# EAGLE design test_board (EAGLE 9.3.1)
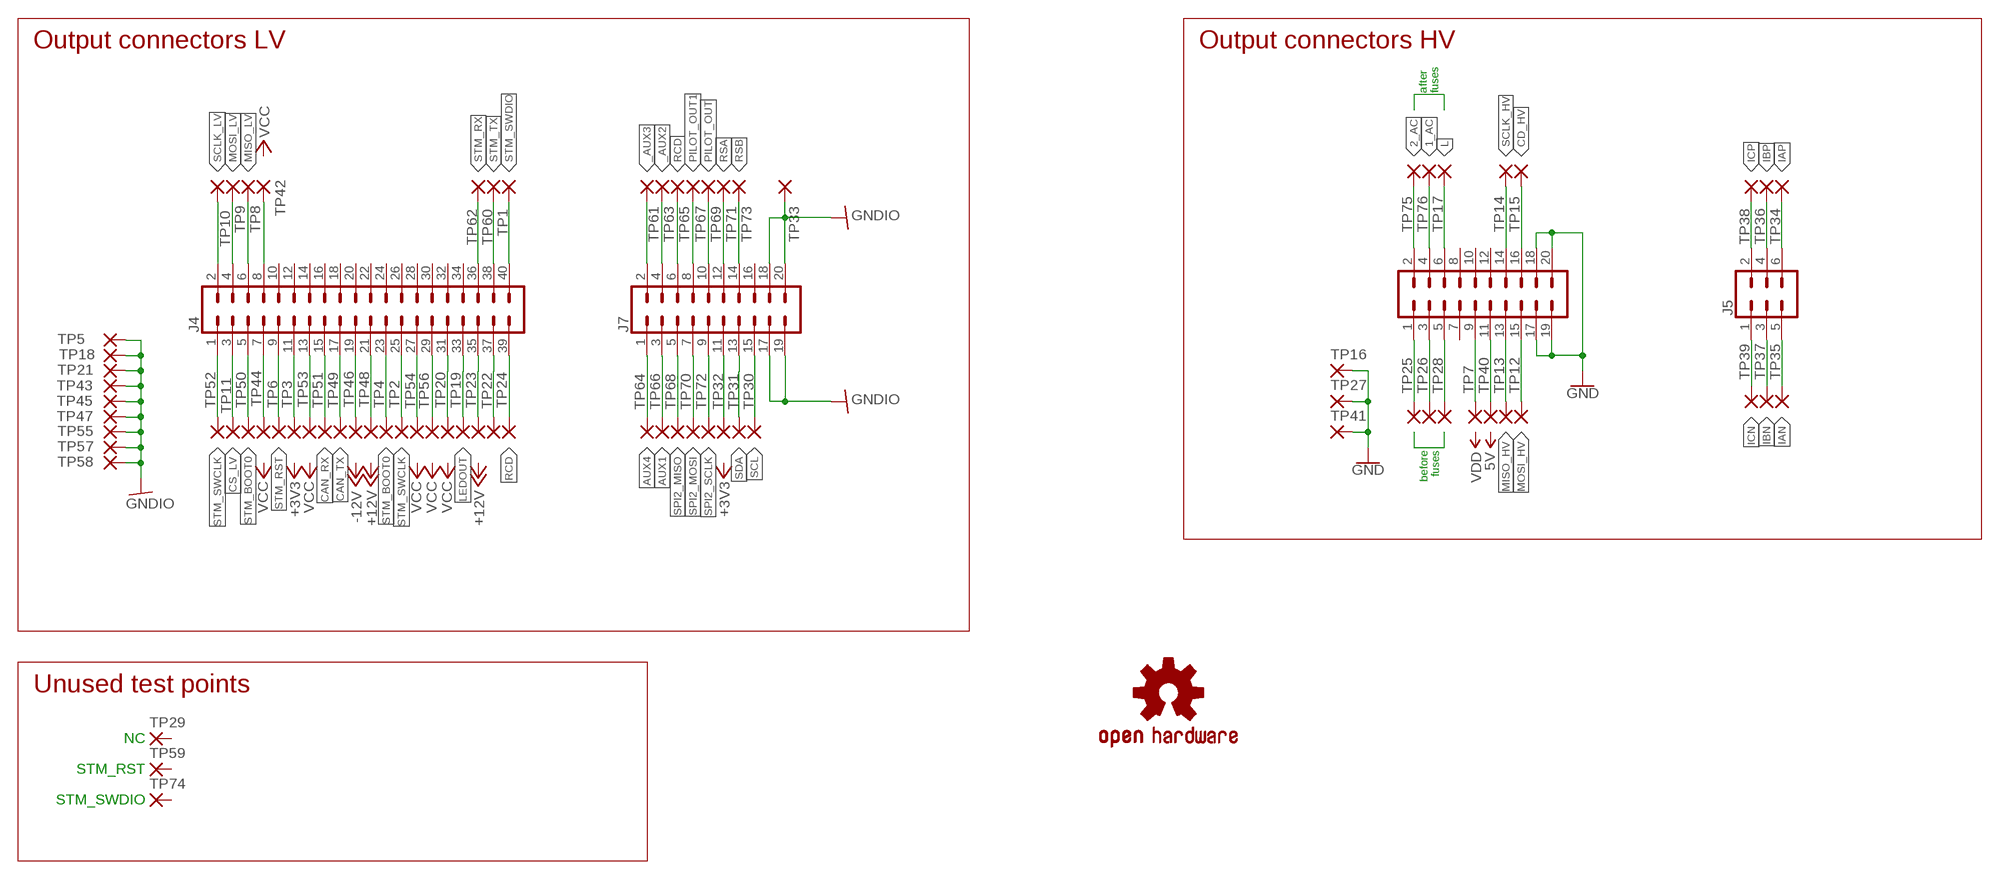
[diagram p0: schematic, sheet 1]

## Parts
J4  CONN_20X2SHROUDED  [2X20_SHROUDED]
J5  CONN_03X2SHROUD  [2X3-SHROUDED]
J7  CONN_10X2  [2X10]
J8  CONN_10X2  [2X10]
TP1  1.35_HOLEROUND  [2,2/1,35_ROUND]
TP2  1.35_HOLEOFFSET  [1,7/1,35_OFFSET]
TP3  1.35_HOLEROUND  [2,2/1,35_ROUND]
TP4  1.35_HOLEROUND  [2,2/1,35_ROUND]
TP5  1.35_HOLELONG  [1,7/1,35_LONG]
TP6  1.35_HOLEROUND  [2,2/1,35_ROUND]
TP7  1.35_HOLEROUND  [2,2/1,35_ROUND]
TP8  1.35_HOLEOFFSET  [1,7/1,35_OFFSET]
TP9  1.35_HOLEOFFSET  [1,7/1,35_OFFSET]
TP10  1.35_HOLEOFFSET  [1,7/1,35_OFFSET]
TP11  1.35_HOLELONG  [1,7/1,35_LONG]
TP12  1.35_HOLEROUND  [2,2/1,35_ROUND]
TP13  1.35_HOLEROUND  [2,2/1,35_ROUND]
TP14  1.35_HOLEOFFSET  [1,7/1,35_OFFSET]
TP15  1.35_HOLEOFFSET  [1,7/1,35_OFFSET]
TP16  1.35_HOLEROUND  [2,2/1,35_ROUND]
TP17  1.35_HOLEROUND  [2,2/1,35_ROUND]
TP18  1.35_HOLELONG  [1,7/1,35_LONG]
TP19  1.35_HOLELONG  [1,7/1,35_LONG]
TP20  1.35_HOLELONG  [1,7/1,35_LONG]
TP21  1.35_HOLELONG  [1,7/1,35_LONG]
TP22  1.35_HOLELONG  [1,7/1,35_LONG]
TP23  1.35_HOLELONG  [1,7/1,35_LONG]
TP24  1.35_HOLELONG  [1,7/1,35_LONG]
TP25  1.35_HOLEROUND  [2,2/1,35_ROUND]
TP26  1.35_HOLEROUND  [2,2/1,35_ROUND]
TP27  1.35_HOLEROUND  [2,2/1,35_ROUND]
TP28  1.35_HOLEROUND  [2,2/1,35_ROUND]
TP29  1.35_HOLELONG  [1,7/1,35_LONG]
TP30  1.35_HOLELONG  [1,7/1,35_LONG]
TP31  1.35_HOLELONG  [1,7/1,35_LONG]
TP32  1.35_HOLELONG  [1,7/1,35_LONG]
TP33  1.35_HOLELONG  [1,7/1,35_LONG]
TP34  1.35_HOLELONG  [1,7/1,35_LONG]
TP35  1.35_HOLELONG  [1,7/1,35_LONG]
TP36  1.35_HOLELONG  [1,7/1,35_LONG]
TP37  1.35_HOLELONG  [1,7/1,35_LONG]
TP38  1.35_HOLELONG  [1,7/1,35_LONG]
TP39  1.35_HOLELONG  [1,7/1,35_LONG]
TP40  1.35_HOLELONG  [1,7/1,35_LONG]
TP41  1.35_HOLELONG  [1,7/1,35_LONG]
TP42  1.35_HOLELONG  [1,7/1,35_LONG]
TP43  1.35_HOLELONG  [1,7/1,35_LONG]
TP44  1.35_HOLELONG  [1,7/1,35_LONG]
TP45  1.35_HOLELONG  [1,7/1,35_LONG]
TP46  1.35_HOLELONG  [1,7/1,35_LONG]
TP47  1.35_HOLELONG  [1,7/1,35_LONG]
TP48  1.35_HOLELONG  [1,7/1,35_LONG]
TP49  1.35_HOLEROUND  [2,2/1,35_ROUND]
TP50  1.35_HOLEROUND  [2,2/1,35_ROUND]
TP51  1.35_HOLEROUND  [2,2/1,35_ROUND]
TP52  1.35_HOLEROUND  [2,2/1,35_ROUND]
TP53  1.35_HOLEROUND  [2,2/1,35_ROUND]
TP54  1.35_HOLEROUND  [2,2/1,35_ROUND]
TP55  1.35_HOLEROUND  [2,2/1,35_ROUND]
TP56  1.35_HOLEROUND  [2,2/1,35_ROUND]
TP57  1.35_HOLEROUND  [2,2/1,35_ROUND]
TP58  1.35_HOLEROUND  [2,2/1,35_ROUND]
TP59  1.35_HOLEROUND  [2,2/1,35_ROUND]
TP60  1.35_HOLEROUND  [2,2/1,35_ROUND]
TP61  1.35_HOLEROUND  [2,2/1,35_ROUND]
TP62  1.35_HOLEROUND  [2,2/1,35_ROUND]
TP63  1.35_HOLEROUND  [2,2/1,35_ROUND]
TP64  1.35_HOLEROUND  [2,2/1,35_ROUND]
TP65  1.35_HOLEROUND  [2,2/1,35_ROUND]
TP66  1.35_HOLEROUND  [2,2/1,35_ROUND]
TP67  1.35_HOLEROUND  [2,2/1,35_ROUND]
TP68  1.35_HOLEROUND  [2,2/1,35_ROUND]
TP69  1.35_HOLEROUND  [2,2/1,35_ROUND]
TP70  1.35_HOLEROUND  [2,2/1,35_ROUND]
TP71  1.35_HOLEROUND  [2,2/1,35_ROUND]
TP72  1.35_HOLEROUND  [2,2/1,35_ROUND]
TP73  1.35_HOLEROUND  [2,2/1,35_ROUND]
TP74  1.35_HOLEROUND  [2,2/1,35_ROUND]
TP75  1.35_HOLEROUND  [2,2/1,35_ROUND]
TP76  1.35_HOLEROUND  [2,2/1,35_ROUND]
U$1  OSHW-LOGOL  [OSHW-LOGO-L]

## Nets
1_AC: J8.4 TP76.1(P)
2_AC: J8.2 TP75.1(P)
_AUX2: J7.4 TP63.1(P)
_AUX3: J7.2 TP61.1(P)
AUX1: J7.3 TP66.1(P)
AUX4: J7.1 TP64.1(P)
CAN_RX: J4.15 TP51.1(P)
CAN_TX: J4.17 TP49.1(P)
CD_HV: J8.16 TP15.1(P)
CS_LV: J4.3 TP11.1(P)
GND: J8.17 J8.18 J8.19 J8.20 TP16.1(P) TP27.1(P) TP41.1(P)
GNDIO: J7.17 J7.18 J7.19 J7.20 TP5.1(P) TP18.1(P) TP21.1(P) TP33.1(P) TP43.1(P) TP45.1(P) TP47.1(P) TP55.1(P) TP57.1(P) TP58.1(P)
IAN: J5.5 TP35.1(P)
IAP: J5.6 TP34.1(P)
IBN: J5.3 TP37.1(P)
IBP: J5.4 TP36.1(P)
ICN: J5.1 TP39.1(P)
ICP: J5.2 TP38.1(P)
L: J8.6 TP17.1(P)
LEDOUT: J4.33 TP19.1(P)
MISO_HV: J8.13 TP13.1(P)
MISO_LV: J4.6 TP8.1(P)
MOSI_HV: J8.15 TP12.1(P)
MOSI_LV: J4.4 TP9.1(P)
N$1: J4.31 TP20.1(P)
N$4: J7.11 TP32.1(P)
N$6: J4.8 TP42.1(P)
N$9: J4.37 TP22.1(P)
N$13: J4.29 TP56.1(P)
N$14: J8.11 TP40.1(P)
N$15: J8.9 TP7.1(P)
N$19: J4.27 TP54.1(P)
N$20: J4.11 TP3.1(P)
N$21: J4.13 TP53.1(P)
N$22: J4.35 TP23.1(P)
N$23: J4.19 TP46.1(P)
N$24: J4.21 TP48.1(P)
N$25: J4.7 TP44.1(P)
N$35: J8.1 TP25.1(P)
N$36: J8.3 TP26.1(P)
N$37: J8.5 TP28.1(P)
PILOT_OUT: J7.10 TP69.1(P)
PILOT_OUT1: J7.8 TP67.1(P)
RCD: J4.39 J7.6 TP24.1(P) TP65.1(P)
RSA: J7.12 TP71.1(P)
RSB: J7.14 TP73.1(P)
SCL: J7.15 TP30.1(P)
SCLK_HV: J8.14 TP14.1(P)
SCLK_LV: J4.2 TP10.1(P)
SDA: J7.13 TP31.1(P)
SPI2_MISO: J7.5 TP68.1(P)
SPI2_MOSI: J7.7 TP70.1(P)
SPI2_SCLK: J7.9 TP72.1(P)
STM_BOOT0: J4.5 J4.23 TP4.1(P) TP50.1(P)
STM_RST: J4.9 TP6.1(P)
STM_RX: J4.36 TP62.1(P)
STM_SWCLK: J4.1 J4.25 TP2.1(P) TP52.1(P)
STM_SWDIO: J4.40 TP1.1(P)
STM_TX: J4.38 TP60.1(P)
Unconnected: J4.10 J4.12 J4.14 J4.16 J4.18 J4.20 J4.22 J4.24 J4.26 J4.28 J4.30 J4.32 J4.34 J7.16 J8.7 J8.8 J8.10 J8.12 TP29.1(P) TP59.1(P) TP74.1(P)

## Notes on the sheet
- Output connectors LV | Output connectors HV
- after 
  fuses
- before
  fuses
- Unused test points
- NC
- STM_RST
- STM_SWDIO

## Library data of the parts
J4 = SparkFun-Connectors:CONN_20X2: Multi connection point. Often used as Generic Header-pin footprint for 0.1 inch spaced/style header connections On any of the 0.1 inch spaced packages, you can populate with these: Break Away Headers - Straight <https://www.sparkfun.com/products/116> (PRT-00116) Break Away Male Headers - Right Angle <https://www.sparkfun.com/products/553> (PRT-00553) Female Headers <https://www.sparkfun.com/products/115> (PRT-00115) Break Away Headers - Machine Pin <https://www.sparkfun.com/products/117> (PRT-00117) Break Away Female Headers - Swiss Machine Pin <https://www.sparkfun.com/products/743> (PRT-00743); PROD_ID: CONN-12263; SF_ID: CONN-12263
J5 = SparkFun-Connectors:CONN_03X2: Multi connection point. Often used as Generic Header-pin footprint for 0.1 inch spaced/style header connections You can populate with any combo of single row headers, but if you'd like an exact match, check these: Header - 2x3 (Male, 0.1") <https://www.sparkfun.com/products/12807> (PRT-12807) Header - 2x3 (Female, 0.1") <https://www.sparkfun.com/products/13010> (PRT-13010) 2x3 Pin Shrouded Header <https://www.sparkfun.com/products/10877> (PRT-10877) On any of the 0.1 inch spaced packages, you can populate with these: Break Away Headers - Straight <https://www.sparkfun.com/products/116> (PRT-00116) Break Away Male Headers - Right Angle <https://www.sparkfun.com/products/553> (PRT-00553) Female Headers <https://www.sparkfun.com/products/115> (PRT-00115) Break Away Headers - Machine Pin <https://www.sparkfun.com/products/117> (PRT-00117) Break Away Female Headers - Swiss Machine Pin <https://www.sparkfun.com/products/743> (PRT-00743) Special note: the shrouded connector mates well with our 3x2 ribbon cables: Ribbon Crimp Connector - 6-pin (2x3, Female) <https://www.sparkfun.com/products/10651> (PRT-10651) Ribbon Cable - 6 wire (15ft) <https://www.sparkfun.com/products/10646> (PRT-10646); PROD_ID: CONN-10681; SF_ID: PRT_10877
J7 J8 = SparkFun-Connectors:CONN_10X2: Multi connection point. Often used as Generic Header-pin footprint for 0.1 inch spaced/style header connections On any of the 0.1 inch spaced packages, you can populate with these: Break Away Headers - Straight <https://www.sparkfun.com/products/116> (PRT-00116) Break Away Male Headers - Right Angle <https://www.sparkfun.com/products/553> (PRT-00553) Female Headers <https://www.sparkfun.com/products/115> (PRT-00115) Break Away Headers - Machine Pin <https://www.sparkfun.com/products/117> (PRT-00117) Break Away Female Headers - Swiss Machine Pin <https://www.sparkfun.com/products/743> (PRT-00743) Special note about the "SPECIAL" package: This was SPECIALLY designed to be used with our Graphic LCD Backpack. Be sure you want to use this! It is not only staggered on each line of header holes, but IT IS ALSO offset of the center point of the top and bottom lines by 5 mil. This causes the headers to lock into place on the "standard" footprint on the LCD screen. The extra squares on the tdocu layer are there simply to reference other pins (if you were to actually populate a longer header than ten long - this is what we do with the backpacks).
TP1-TP76 = Brunez:1.35_HOLE: THROUGH-HOLE PAD
U$1 = mastrogippo:OSHW-LOGO: Open Source Hardware Logo This logo indicates the piece of hardware it is found on incorporates a OSHW license and/or adheres to the definition of open source hardware found here: http://freedomdefined.org/OSHW

## Net classes
1 pwr: width 0.305 mm, drill 0.356 mm, clearance 0.152 mm
2 analog: width 0.305 mm, drill 0.33 mm, clearance 0.152 mm

## Board
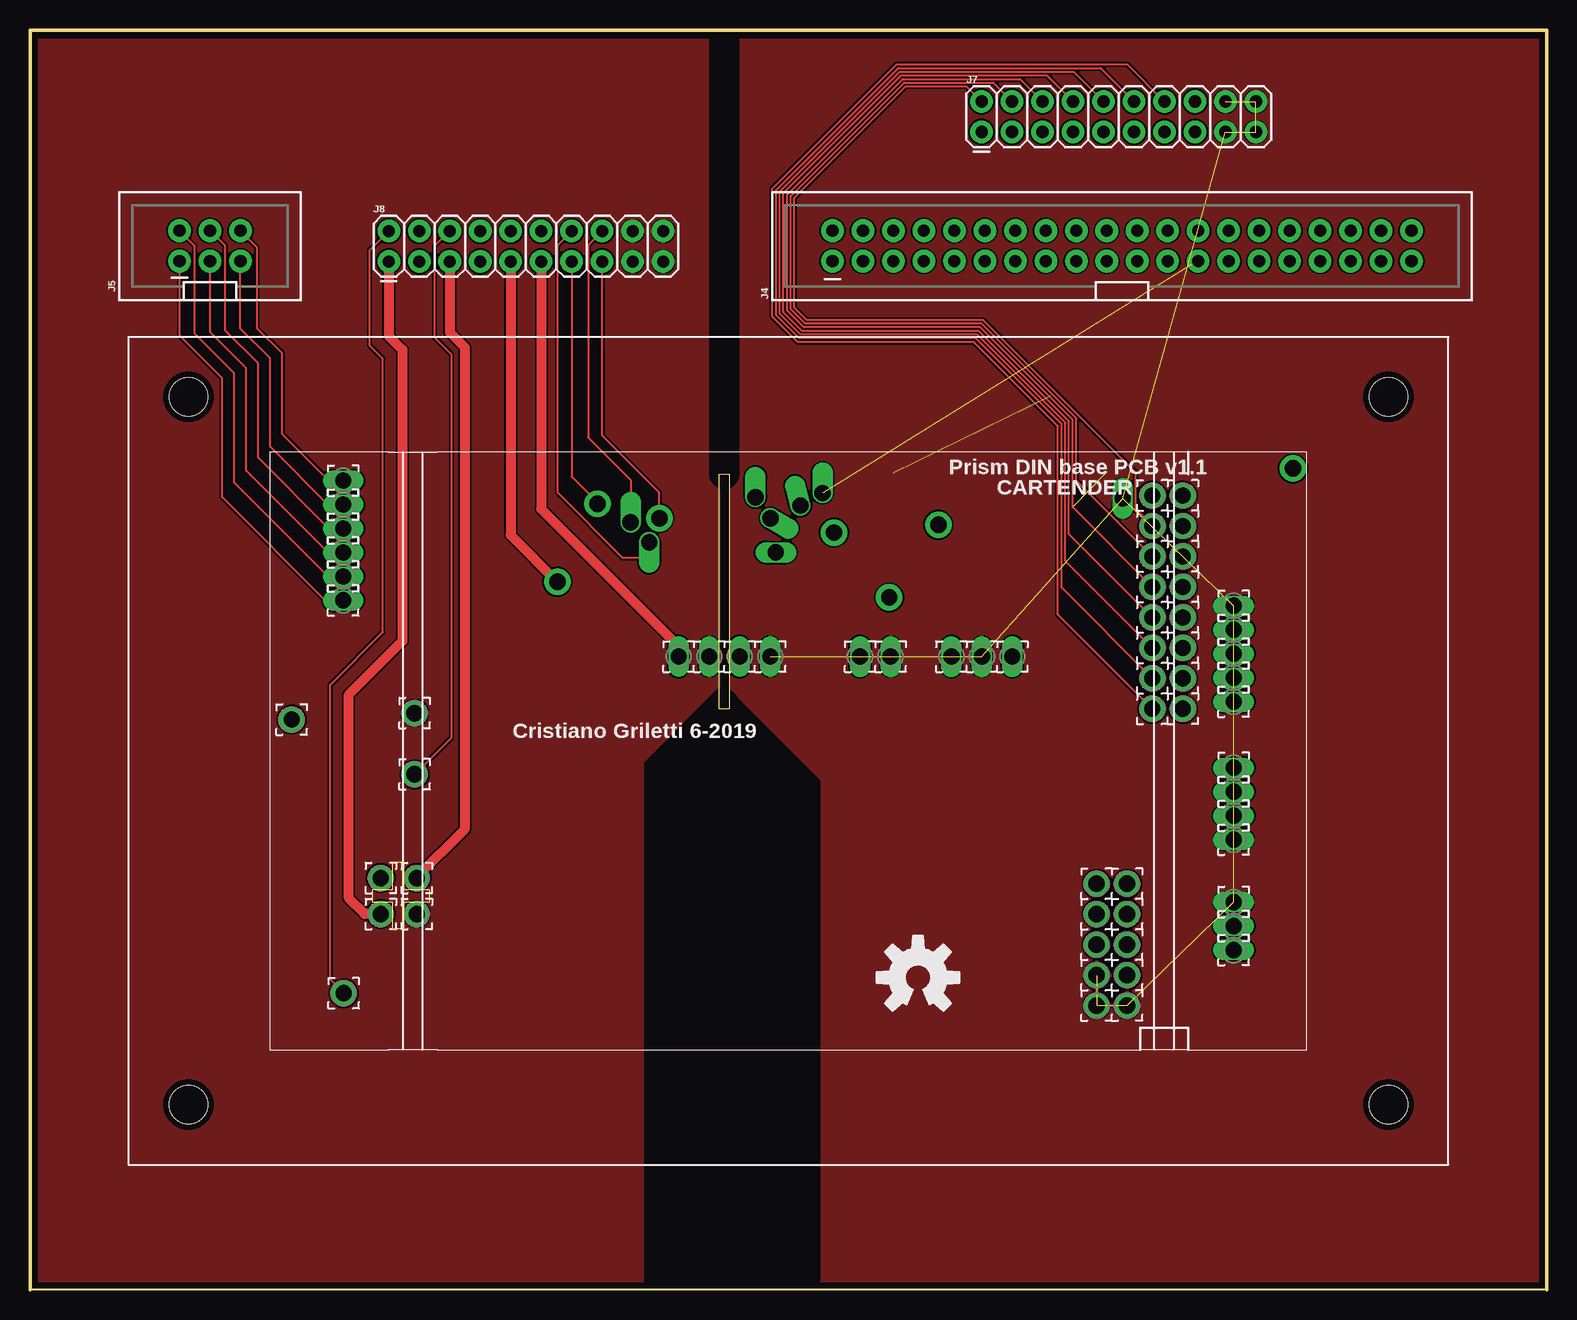
[diagram p1: board, top side]
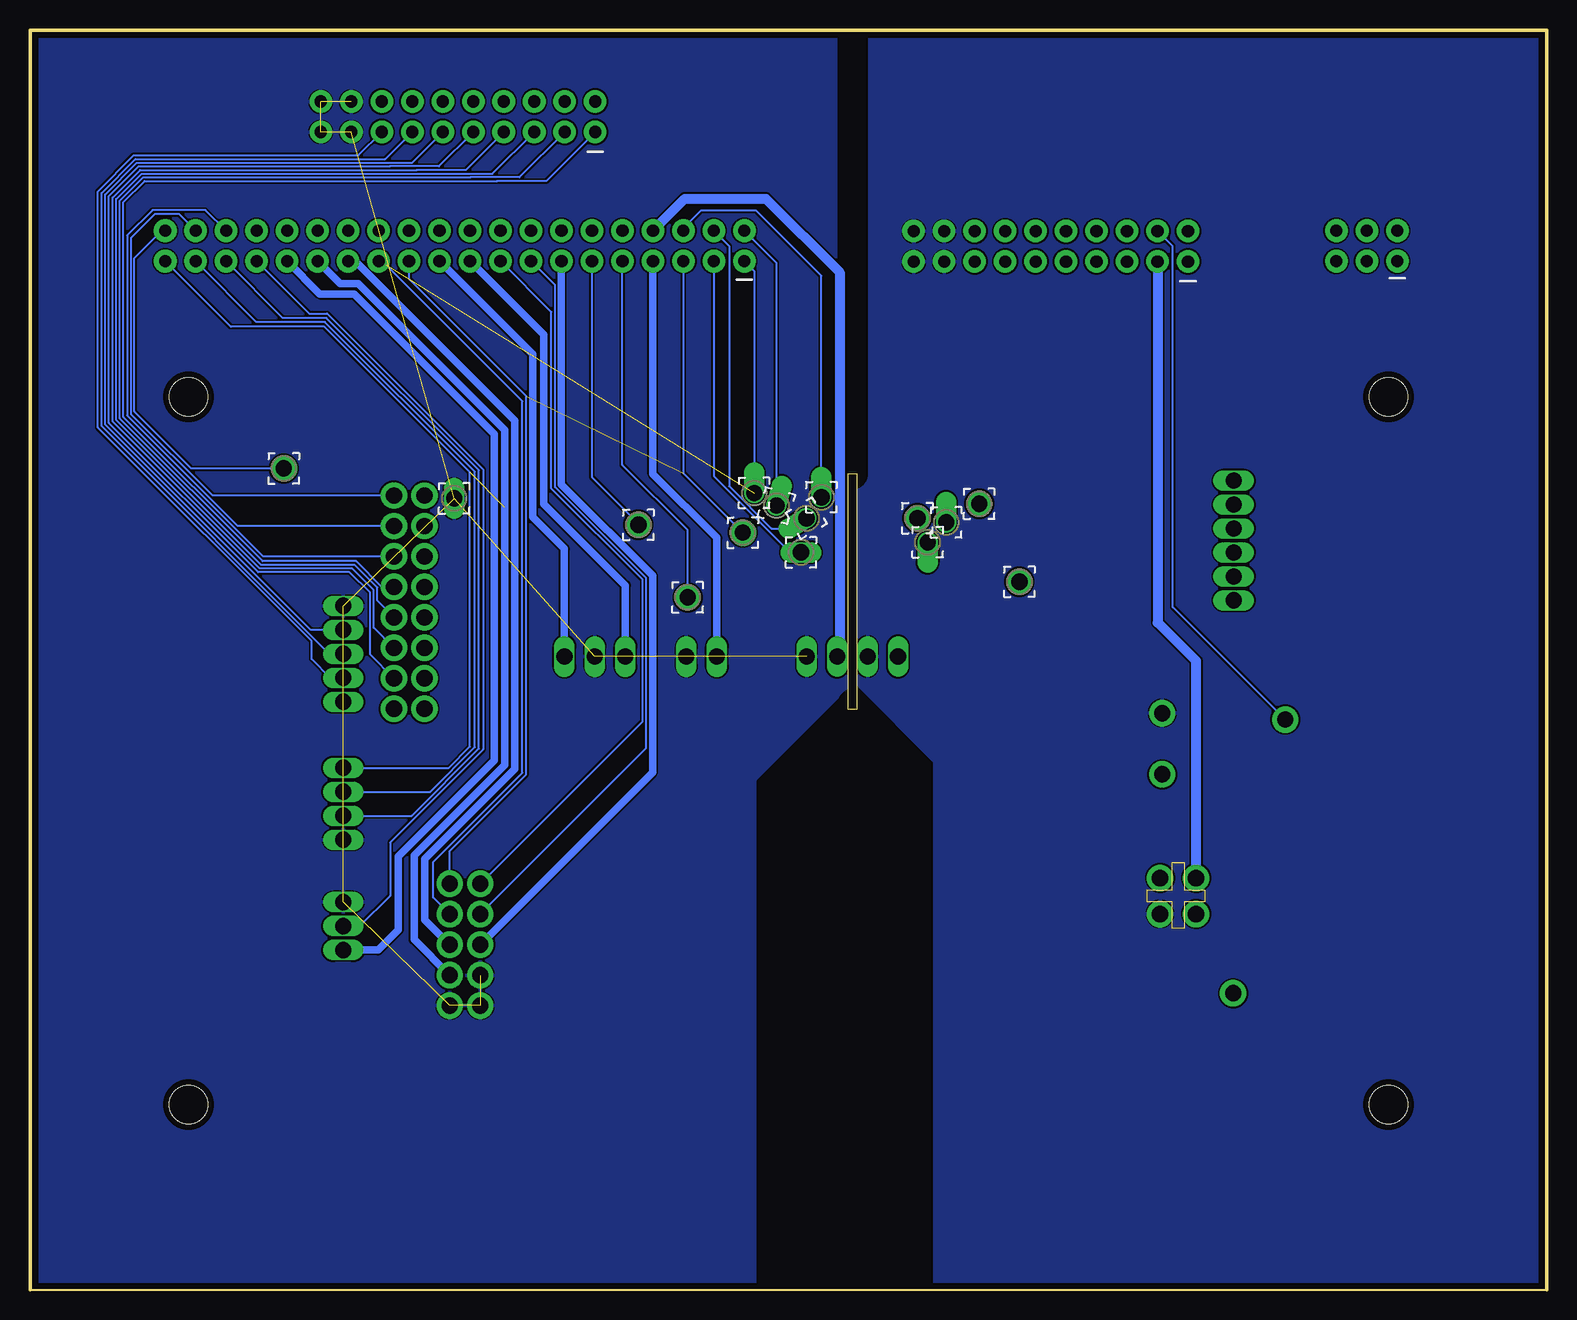
[diagram p2: board, bottom side, seen from below]

Size 126.4 x 105 mm. Coordinates in mm from the lower left corner, seen from the top.
Outline: 0,105 126.4,105 126.4,0 0,0 0,105
Copper layers (1*16): Top 0.035mm / dielectric 1.5mm / Bottom 0.035mm
Design rules "default *": minimum track width 6mil, minimum drill 0.29mm, track to track 6mil, track to pad 6mil, pad to pad 6mil, via to via 6mil, smd to smd 0mil, copper to edge 20mil, drill to drill 6mil, minimum pad ring 5mil, minimum via ring 8mil, stop-mask expansion 4mil, vias tented up to drill 20mil, thermal gap 4mil
Holes 3.2 mm at 13.2,74.4 13.2,15.4 113.2,15.4 113.2,74.4
tRestrict: 2 lines
bRestrict: 2 lines
Milling: 16 lines

### Footprints (pad centres in the part's own frame; a part is rotated, then mirrored left to right if it is on the bottom)
2X20_SHROUDED = drill 1.016 pad 1.88: 1 -1.27,24.13; 2 1.27,24.13; 3 -1.27,21.59; 4 1.27,21.59; 5 -1.27,19.05; 6 1.27,19.05; 7 -1.27,16.51; 8 1.27,16.51; 9 -1.27,13.97; 10 1.27,13.97; 11 -1.27,11.43; 12 1.27,11.43; 13 -1.27,8.89; 14 1.27,8.89; 15 -1.27,6.35; 16 1.27,6.35; 17 -1.27,3.81; 18 1.27,3.81; 19 -1.27,1.27; 20 1.27,1.27; 21 -1.27,-1.27; 22 1.27,-1.27; 23 -1.27,-3.81; 24 1.27,-3.81; 25 -1.27,-6.35; 26 1.27,-6.35; 27 -1.27,-8.89; 28 1.27,-8.89; 29 -1.27,-11.43; 30 1.27,-11.43; 31 -1.27,-13.97; 32 1.27,-13.97; 33 -1.27,-16.51; 34 1.27,-16.51; 35 -1.27,-19.05; 36 1.27,-19.05; 37 -1.27,-21.59; 38 1.27,-21.59; 39 -1.27,-24.13; 40 1.27,-24.13
2X3-SHROUDED = drill 1.016 pad 1.88: 1 -1.27,2.54; 2 1.27,2.54; 3 -1.27,0; 4 1.27,0; 5 -1.27,-2.54; 6 1.27,-2.54
2X10 = drill 1.016 pad 1.88: 1 0,0; 2 0,2.54; 3 2.54,0; 4 2.54,2.54; 5 5.08,0; 6 5.08,2.54; 7 7.62,0; 8 7.62,2.54; 9 10.16,0; 10 10.16,2.54; 11 12.7,0; 12 12.7,2.54; 13 15.24,0; 14 15.24,2.54; 15 17.78,0; 16 17.78,2.54; 17 20.32,0; 18 20.32,2.54; 19 22.86,0; 20 22.86,2.54
2,2/1,35_ROUND = drill 1.35 pad 2.2: 1 0,0
1,7/1,35_OFFSET = drill 1.35 pad 1.7 offset: 1 0,0
1,7/1,35_LONG = drill 1.35 pad 1.7 long: 1 0,0

### Placement (x,y rotation side)
J4  91,87 90 top
J5  15,87 90 top
J7  79.3,96.5 0 top
J8  29.9,85.7 0 top
TP1  105.25,68.45 0 bottom
TP2  66.05,66.4 90 bottom
TP3  75.7,63.75 0 bottom
TP4  67,63.1 0 bottom
TP5  91.05,65.95 270 bottom
TP6  71.6,57.7 0 bottom
TP7  43.95,59 0 bottom
TP8  60.45,66.05 90 bottom
TP9  61.7,64.3 210 bottom
TP10  64.2,65.35 75 bottom
TP11  62.15,61.45 180 bottom
TP12  52.45,64.3 180 bottom
TP13  47.3,65.5 0 bottom
TP14  51.6,62.3 270 bottom
TP15  50.05,63.95 90 bottom
TP16  32.05,48.05 0 top
TP17  32.05,42.95 0 top
TP18  100.3,32.3 0 top
TP19  100.3,30.3 0 top
TP20  100.3,28.3 0 top
TP21  100.3,37.5 0 top
TP22  100.3,41.5 0 top
TP23  100.3,39.5 0 top
TP24  100.3,43.5 0 top
TP25  29.23,31.3 0 top
TP26  29.23,34.3 0 top
TP27  32.23,31.3 0 top
TP28  32.23,34.3 0 top
TP29  100.3,49 0 top
TP30  100.3,51 0 top
TP31  100.3,53 0 top
TP32  100.3,55 0 top
TP33  100.3,57 0 top
TP34  26.1,67.43 0 top
TP35  26.1,65.43 0 top
TP36  26.1,63.44 0 top
TP37  26.1,61.44 0 top
TP38  26.1,59.45 0 top
TP39  26.1,57.45 0 top
TP40  54.06,52.77 90 top
TP41  56.6,52.77 90 top
TP42  59.14,52.77 90 top
TP43  61.68,52.77 90 top
TP44  69.17,52.76 90 top
TP45  71.71,52.76 90 top
TP46  76.79,52.76 90 top
TP47  79.33,52.76 90 top
TP48  81.86,52.76 90 top
TP49  88.88,33.83 0 top
TP50  91.42,33.83 0 top
TP51  88.88,31.3 0 top
TP52  91.42,31.3 0 top
TP53  88.88,28.75 0 top
TP54  91.42,28.75 0 top
TP55  88.88,26.2 0 top
TP56  91.42,26.2 0 top
TP57  88.88,23.67 0 top
TP58  91.42,23.67 0 top
TP59  93.53,66.19 0 top
TP60  96.07,66.19 0 top
TP61  93.53,63.65 0 top
TP62  96.07,63.65 0 top
TP63  93.53,61.11 0 top
TP64  96.07,61.11 0 top
TP65  93.53,58.57 0 top
TP66  96.07,58.57 0 top
TP67  93.53,56.03 0 top
TP68  96.07,56.03 0 top
TP69  93.53,53.49 0 top
TP70  96.07,53.49 0 top
TP71  93.53,50.95 0 top
TP72  96.07,50.95 0 top
TP73  93.53,48.41 0 top
TP74  96.07,48.41 0 top
TP75  26.14,24.7 0 top
TP76  21.8,47.51 0 top
U$1  74,26 0 top

### Tracks (layer width: path | path; a pad name or v marks a point on that pad's centre or on a via)
1_AC
  Bottom 0.152: J8.4 32.43,88.24 31.17,86.98 31.17,56.88 TP76.1
2_AC
  Top 0.152: TP75.1 25,25.84 25,50.4 29.4,54.8 29.4,77.6 28.3,78.7 28.3,86.64 J8.2
_AUX2
  Top 0.152: TP63.1 90.62,64.02 90.6,64.02 87.19,67.43 87.19,72.63 79.3,80.52 64.61,80.52 63.39,81.75 63.39,91.15 72.84,100.61 80.28,100.61 J7.4
_AUX3
  Top 0.152: TP61.1 92.13,65.05 92.13,68.12 79.42,80.83 64.74,80.83 63.7,81.87 63.7,91.03 72.97,100.3 78.04,100.3 J7.2
AUX1
  Bottom 0.152: TP66.1 97.07,58.57 99.22,60.72 107.01,60.72 118.91,72.62 118.91,90.78 116.98,92.71 89.71,92.71 85.63,92.71 J7.3
AUX4
  Bottom 0.152: TP64.1 106.97,61.11 118.61,72.75 118.61,90.65 116.85,92.41 87.47,92.41 83.39,92.41 J7.1
CAN_RX
  Bottom 0.152: TP51.1 75.05,45.13 75.05,59.29 82.64,66.89 82.64,83.72 J4.15
CAN_TX
  Bottom 0.152: TP49.1 75.35,47.36 75.35,59.17 82.95,66.76 82.95,81.49 J4.17
CD_HV
  Top 0.152: TP15.1 50.05,67.5 46.51,71.04 46.51,87.07 J8.16
CS_LV
  Bottom 0.152: J4.3 69.41,67.8 63.06,61.45 TP11.1
GND
  pour Top: -2,106 56.9,106 56.9,67.1 57.4,66.6 57.4,50.4 51,44 51,-4 -2,-4
  pour Bottom: -2,106 56.9,106 56.9,67.1 57.4,66.6 57.4,50.4 51,44 51,-3 -2,-3
GNDIO  (13 unrouted)
  pour Bottom: 132,-4 132,108 58.3,108 58.4,66.6 58.4,50.3 58.3,50.2 66,42.5 66,-2 68,-4
  pour Top: 132,-4 132,108 58.4,108 58.4,50.1 66,42.5 66,-2 68,-4
IAN
  Top 0.152: TP35.1 26.08,65.45 24.8,65.45 20,70.25 20,77.63 17.54,80.09 J5.5
IAP
  Top 0.152: TP34.1 24.9,67.43 21,71.33 21,78.04 18.91,80.13 18.91,86.9 J5.6
IBN
  Top 0.152: TP37.1 26.08,61.46 24.8,61.46 18.01,68.25 18.01,76.81 15,79.82 J5.3
IBP
  Top 0.152: TP36.1 26.08,63.45 24.9,63.45 19.01,69.35 19.01,77.22 16.27,79.96 16.27,87 J5.4
ICN
  Top 0.152: TP39.1 26.02,57.37 24.7,57.37 16.02,66.05 16.02,75.98 12.46,79.54 J5.1
ICP
  Top 0.152: TP38.1 26.08,59.46 24.8,59.46 17.02,67.25 17.02,76.39 13.73,79.68 13.73,87 J5.2
L
  Top 0.152: J8.6 33.7,86.96 33.7,79.4 35.1,78 35.1,46 TP17.1
LEDOUT
  Bottom 0.152: J4.33 103.15,81.37 101.64,81.37 88.63,68.36 88.63,45.04 96.4,37.27 96.4,32.83 98.92,30.3 TP19.1
MISO_HV
  Top 0.152: TP13.1 47.3,65.62 45.14,67.78 J8.13
MISO_LV
  Bottom 0.152: J4.6 71.95,88.48 70.49,89.94 65.89,89.94 60.45,84.5 TP8.1
MOSI_HV
  Top 0.152: J8.15 47.68,71.2 52.45,66.43 TP12.1
MOSI_LV
  Bottom 0.152: J4.4 68.14,87 68.14,66.97 64.62,63.45 62.55,63.45 TP9.1
N$1
  Bottom 0.61: J4.31 102.24,83 99.4,83 87.7,71.3 87.7,44.1 95.7,36.1 95.7,30 97.4,28.3 TP20.1
N$4
  Bottom 0.152: TP32.1 103.02,55 120.13,72.12 120.13,91.28 117.48,93.93 94.57,93.93 J7.11
N$6
  Bottom 0.813: TP42.1 58.94,52.97 58.94,84.8 65.07,90.93 71.83,90.93 J4.8
N$9
  Bottom 0.152: TP22.1 93.05,41.5 89.33,45.22 89.33,68.18 101.82,80.67 107.53,80.67 J4.37
N$13
  Bottom 0.61: TP56.1 94.4,29.18 94.4,36.18 86.84,43.74 86.84,71.66 99.04,83.86 100.56,83.86 J4.29
N$14
  Top 0.813: J8.11 42.6,65.08 54.06,53.62 TP40.1
N$15
  Top 0.813: J8.9 40.06,62.89 TP7.1
N$19
  Bottom 0.61: TP54.1 93.5,30.83 93.5,35.9 86,43.4 86,72.44 99.29,85.73 J4.27
N$20
  Bottom 0.152: J4.11 79.57,67.73 75.7,63.86 TP3.1
N$21
  Bottom 0.152: J4.13 82,85.62 82,67
  Bottom 0.61: TP53.1 74.51,43.12 74.51,59.51 82,67 82.11,67.11 J4.13
N$22
  Bottom 0.152: TP23.1 94.6,39.5 89,45.1 89,68.3 101.7,81 105.32,81 J4.35
N$23
  Bottom 0.61: TP46.1 76.79,58.69 83.6,65.5 83.6,79.6 J4.19
N$24
  Bottom 0.61: TP48.1 81.86,61.76 84.5,64.4 84.5,77.96 J4.21
N$25
  Bottom 0.61: TP44.1 69.17,62.68 74.49,68 J4.7
N$35
  Top 0.813: J8.1 29.9,79.5 31.03,78.37 31.03,54.05 26.57,49.59 26.57,32.61 27.88,31.3 TP25.1
N$36
  Bottom 0.813: TP26.1 29.23,52.4 32.43,55.6 J8.3
N$37
  Top 0.813: TP28.1 32.23,34.38 36.21,38.36 36.21,78.57 34.98,79.8 J8.5
PILOT_OUT
  Top 0.152: TP69.1 86.28,60.74 86.28,72.25 78.92,79.61 64.23,79.61 62.48,81.37 62.48,91.53 72.46,101.52 86.98,101.52 J7.10
PILOT_OUT1
  Top 0.152: TP67.1 86.58,62.98 86.58,72.38 79.05,79.91 64.36,79.91 62.78,81.5 62.78,91.41 72.59,101.21 84.75,101.21 J7.8
RCD  (1 unrouted)
  Top 0.152: TP65.1 86.89,65.21 86.89,72.5 79.17,80.22 64.49,80.22 63.09,81.62 63.09,91.28 72.72,100.91 82.51,100.91 J7.6
  Bottom 0.152: TP24.1 91.5,43.5 89.73,45.26 89.73,68.14 101.86,80.27 109.67,80.27 J4.39
RSA
  Top 0.152: TP71.1 85.97,58.51 85.97,72.13 78.79,79.31 64.11,79.31 62.17,81.24 62.17,91.66 72.34,101.82 89.22,101.82 J7.12
RSB
  Top 0.152: TP73.1 85.67,56.27 85.67,72 78.67,79 63.98,79 61.87,81.12 61.87,91.78 72.21,102.13 91.45,102.13 J7.14
SCL
  Bottom 0.152: TP30.1 101.38,51 102.93,52.55 102.93,54.05 120.74,71.86 120.74,91.54 117.74,94.54 99.04,94.54 J7.15
SCLK_HV
  Top 0.152: TP14.1 51.6,61.5 51.1,61 49.4,61 43.97,66.43 43.97,87.07 J8.14
SCLK_LV
  Bottom 0.152: J4.2 64.2,85.6 TP10.1
SDA
  Bottom 0.152: TP31.1 101.45,53 120.44,71.99 120.44,91.41 117.61,94.24 96.8,94.24 J7.13
SPI2_MISO
  Bottom 0.152: TP68.1 97.46,57.42 97.46,58.53 99.34,60.41 107.14,60.41 119.22,72.5 119.22,90.91 117.11,93.02 87.86,93.02 J7.5
SPI2_MOSI
  Bottom 0.152: TP70.1 97.76,55.18 97.76,58.31 99.56,60.11 107.27,60.11 119.52,72.37 119.52,91.03 117.23,93.32 94.18,93.32 90.1,93.32 J7.7
SPI2_SCLK
  Bottom 0.152: TP72.1 98.07,52.95 98.07,58.09 99.78,59.8 107.39,59.8 119.83,72.24 119.83,91.16 117.36,93.63 96.41,93.63 92.33,93.63 J7.9
STM_BOOT0  (1 unrouted)
  Bottom 0.152: TP50.1 91.42,36.58 85.06,42.94 85.06,74.48 94.81,84.23 J4.23 | J4.5 71.95,68.05 TP4.1
STM_RST
  Bottom 0.152: TP6.1 71.6,63.3 77.03,68.73 J4.9
STM_RX
  Bottom 0.152: TP62.1 109.08,63.65 118.31,72.87 118.31,87.88 116.18,90 111.78,90 J4.36
STM_SWCLK  (1 unrouted)
  Bottom 0.152: TP52.1 92.81,32.69 92.81,35.63 85.37,43.06 85.37,74.05 96.75,85.43 97.05,85.43 J4.25 | J4.1 66.05,84.91 TP2.1
STM_SWDIO
  Bottom 0.152: TP1.1 112.95,68.45 117.69,73.19 117.69,86 115.42,88.27 J4.40
STM_TX
  Bottom 0.152: TP60.1 111.19,66.19 118,73 118,87.65 116.01,89.64 113.96,89.64 J4.38

### Text on the board
tNames: Prism DIN base PCB v1.1 | CARTENDER | Cristiano Griletti 6-2019